# EAGLE schematic ModuleCarrier-MTS-Dragonfly (EAGLE 7.7.0)

## Sheet 1 of 2
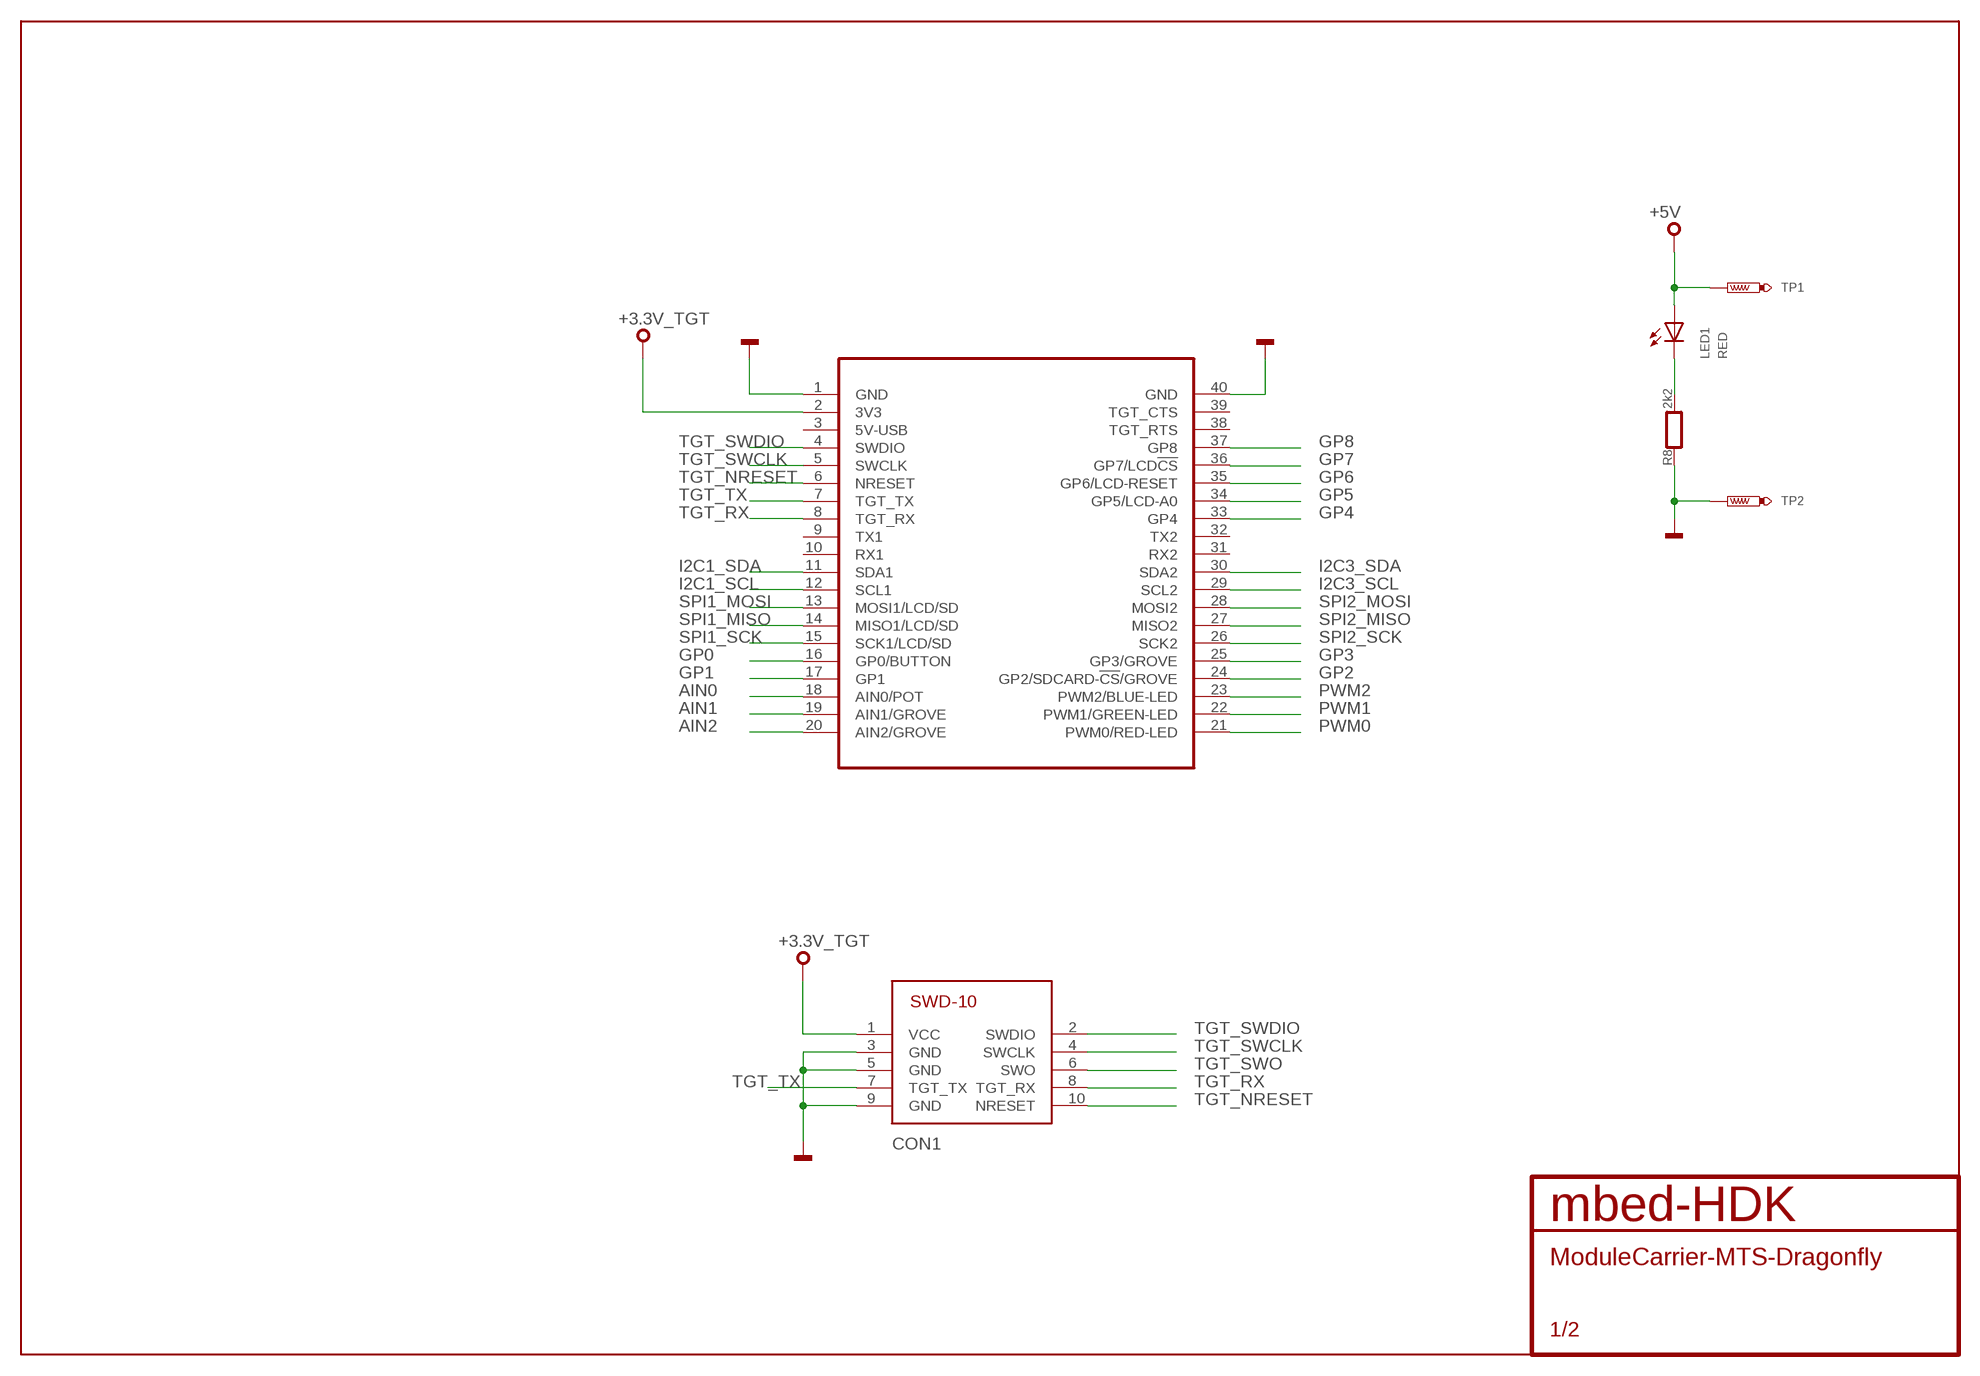
[diagram p0: schematic, sheet 1]

### Parts
CON1  SWD-10/TC2050_SMD  [FTSH-105-02]
LED1  RED  SMD_LED0603  [CHIPLED_0603]
MOD2  MODULE_DAUGHTER  [MODULE_DAUGHTER]
R8  2k2  RESISTOR0603  [0603]
TP1  TEST-POINT-50R-PTH  [TP50-PTH]
TP2  TEST-POINT-50R-PTH  [TP50-PTH]

### Nets
+3.3V_TGT: CON1.1(VCC) MOD2.2(3V3)
+5V: LED1.A TP1.TP ; also sheet 2
AIN0: MOD2.18(AIN0/POT) ; also sheet 2
AIN1: MOD2.19(AIN1/GROVE) ; also sheet 2
AIN2: MOD2.20(AIN2/GROVE) ; also sheet 2
GND: CON1.3(GND) CON1.5(GND) CON1.9(GND) MOD2.1(GND) MOD2.40(GND) R8.1 TP2.TP ; also sheet 2
GP0: MOD2.16(GP0/BUTTON) ; also sheet 2
GP1: MOD2.17(GP1) ; also sheet 2
GP2: MOD2.24(GP2/SDCARD-!CS!/GROVE) ; also sheet 2
GP3: MOD2.25(GP3/GROVE) ; also sheet 2
GP4: MOD2.33(GP4) ; also sheet 2
GP5: MOD2.34(GP5/LCD-A0) ; also sheet 2
GP6: MOD2.35(GP6/LCD-RESET) ; also sheet 2
GP7: MOD2.36(GP7/LCD!CS) ; also sheet 2
GP8: MOD2.37(GP8) ; also sheet 2
I2C1_SCL: MOD2.12(SCL1) ; also sheet 2
I2C1_SDA: MOD2.11(SDA1) ; also sheet 2
I2C3_SCL: MOD2.29(SCL2) ; also sheet 2
I2C3_SDA: MOD2.30(SDA2) ; also sheet 2
PA_1: LED1.C R8.2
PWM0: MOD2.21(PWM0/RED-LED) ; also sheet 2
PWM1: MOD2.22(PWM1/GREEN-LED) ; also sheet 2
PWM2: MOD2.23(PWM2/BLUE-LED) ; also sheet 2
SPI1_MISO: MOD2.14(MISO1/LCD/SD) ; also sheet 2
SPI1_MOSI: MOD2.13(MOSI1/LCD/SD) ; also sheet 2
SPI1_SCK: MOD2.15(SCK1/LCD/SD) ; also sheet 2
SPI2_MISO: MOD2.27(MISO2) ; also sheet 2
SPI2_MOSI: MOD2.28(MOSI2) ; also sheet 2
SPI2_SCK: MOD2.26(SCK2) ; also sheet 2
TGT_NRESET: CON1.10(NRESET) MOD2.6(NRESET) ; also sheet 2
TGT_RX: CON1.8(TGT_RX) MOD2.8(TGT_RX) ; also sheet 2
TGT_SWCLK: CON1.4(SWCLK) MOD2.5(SWCLK) ; also sheet 2
TGT_SWDIO: CON1.2(SWDIO) MOD2.4(SWDIO) ; also sheet 2
TGT_SWO: CON1.6(SWO) ; also sheet 2
TGT_TX: CON1.7(TGT_TX) MOD2.7(TGT_TX) ; also sheet 2
Unconnected: MOD2.3(5V-USB) MOD2.9(TX1) MOD2.10(RX1) MOD2.31(RX2) MOD2.32(TX2) MOD2.38(TGT_RTS) MOD2.39(TGT_CTS)

## Sheet 2 of 2
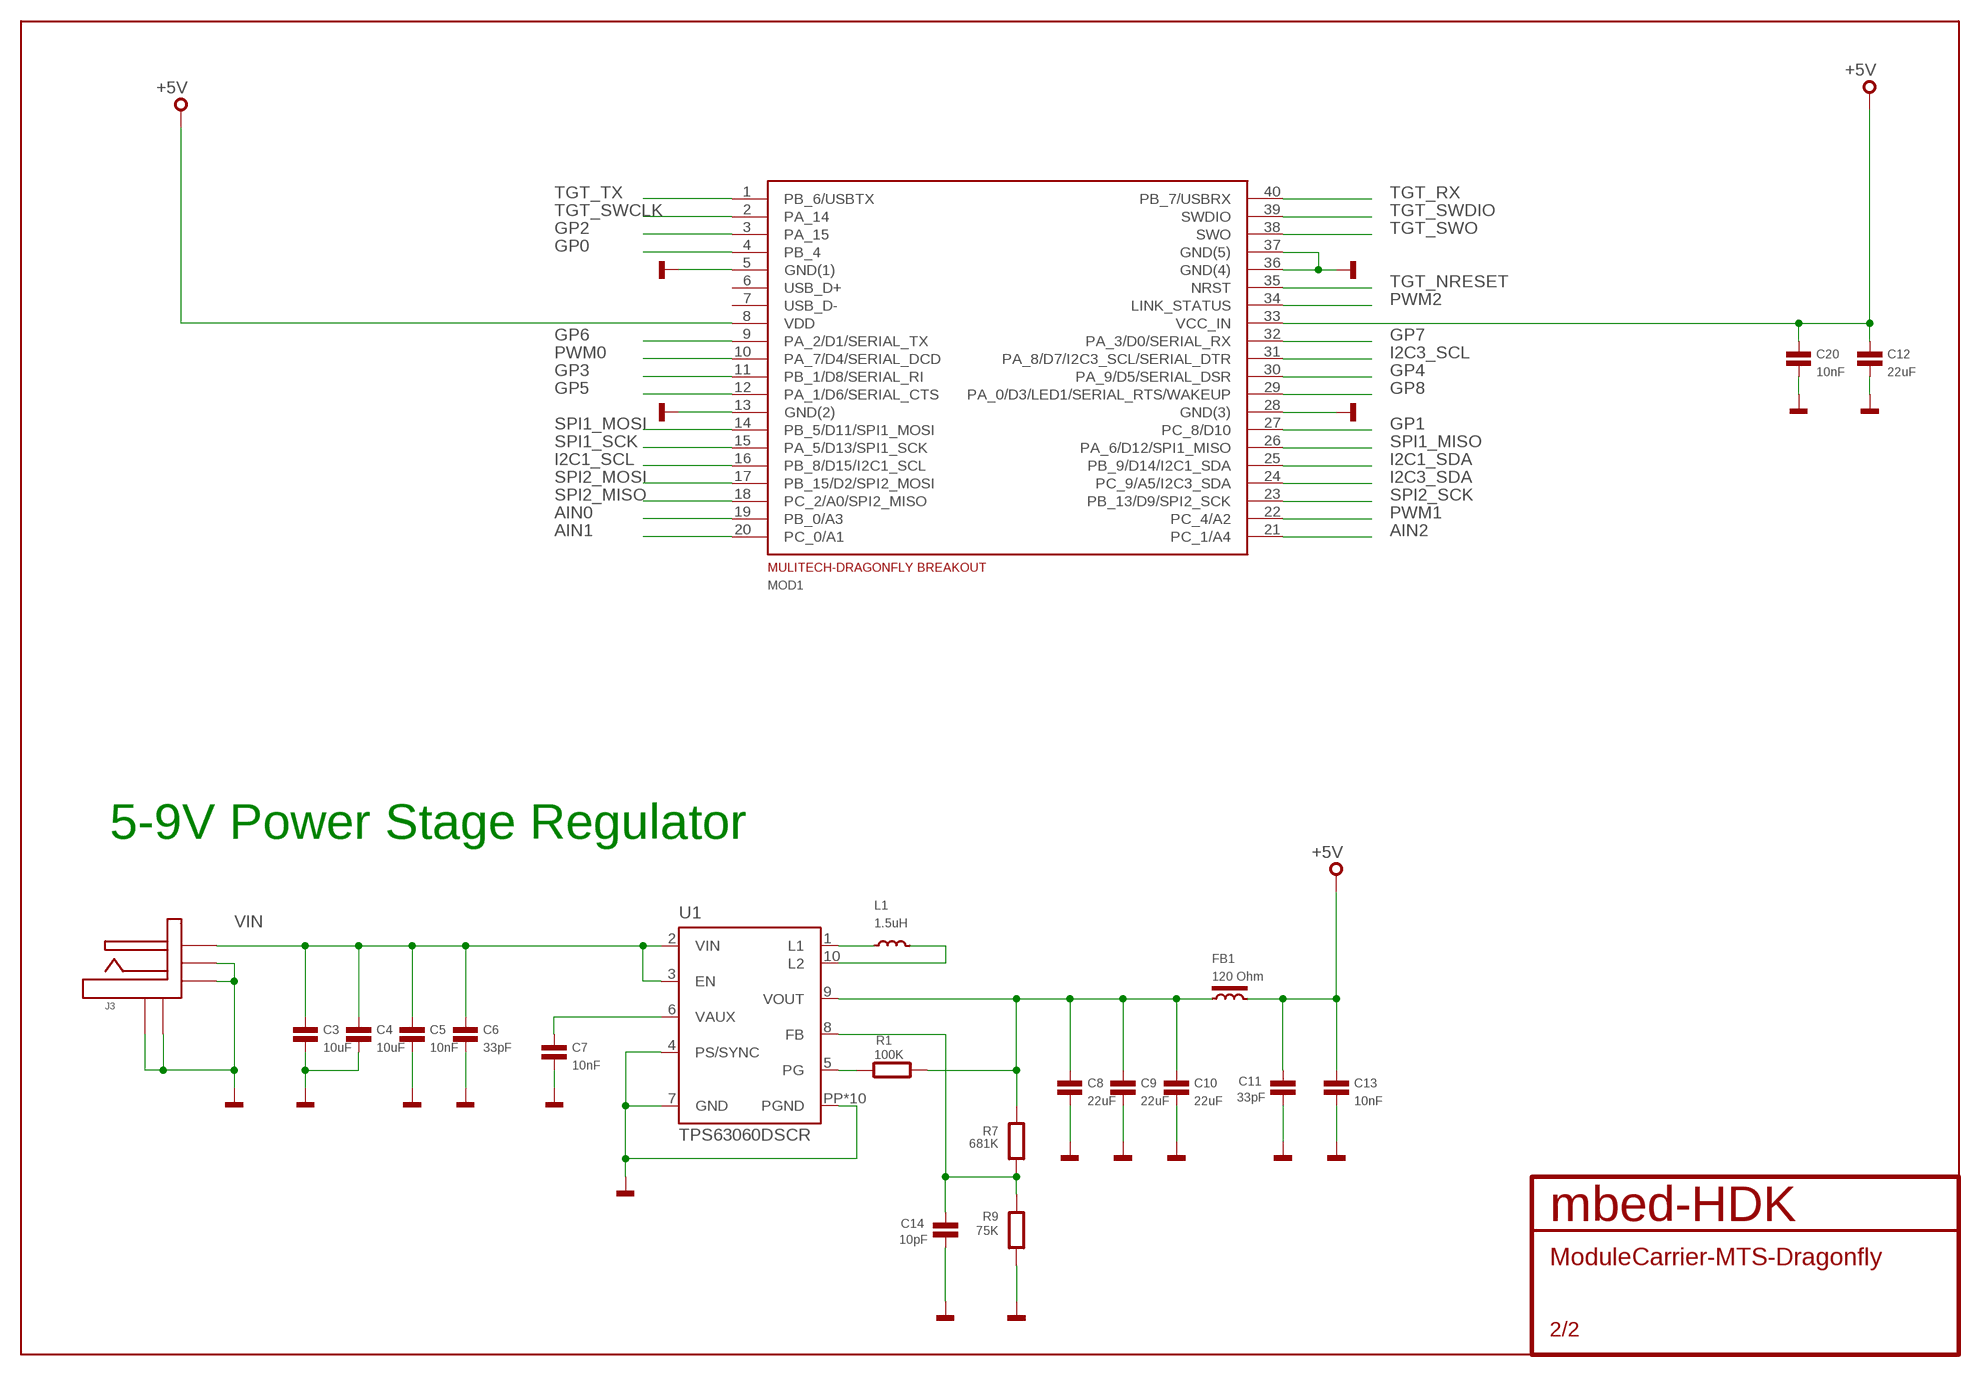
[diagram p1: schematic, sheet 2]

### Parts
C3  10uF  CAPACITOR0603  [0603]
C4  10uF  CAPACITOR0603  [0603]
C5  10nF  CAPACITOR0603  [0603]
C6  33pF  CAPACITOR0603  [0603]
C7  10nF  CAPACITOR0603  [0603]
C8  22uF  CAPACITOR0603  [0603]
C9  22uF  CAPACITOR0603  [0603]
C10  22uF  CAPACITOR0603  [0603]
C11  33pF  CAPACITOR0603  [0603]
C12  22uF  CAPACITOR0603  [0603]
C13  10nF  CAPACITOR0603  [0603]
C14  10pF  CAPACITOR0603  [0603]
C20  10nF  CAPACITOR0603  [0603]
FB1  120 Ohm  FERRITE0603  [0603]
J3  FC68145S  [FC68145S]
L1  1.5uH  INDUCTORXFL4020  [XFL4020-472MEC]
MOD1  MULITECH-DRAGONFLY-BREAKOUT  [MULITECH-DRAGONFLY-BREAKOUT]
R1  100K  RESISTOR0402  [0402]
R7  681K  RESISTOR0402  [0402]
R9  75K  RESISTOR0402  [0402]
U1  TPS63060DSCR  [DSC-S-PWSON-N10]

### Nets
+5V: C11.1 C12.1 C13.1 C20.1 FB1.2 MOD1.8(VDD) MOD1.33(VCC_IN) ; also sheet 1
AIN0: MOD1.19(PB_0/A3) ; also sheet 1
AIN1: MOD1.20(PC_0/A1) ; also sheet 1
AIN2: MOD1.21(PC_1/A4) ; also sheet 1
GND: C3.2 C4.2 C5.2 C6.2 C7.2 C8.2 C9.2 C10.2 C11.2 C12.2 C13.2 C14.2 C20.2 J3.CASE1 J3.P$5(CASE2) J3.SHUNT(SWITCHED) J3.SLEEVE MOD1.5(GND(1)) MOD1.13(GND(2)) MOD1.28(GND(3)) MOD1.36(GND(4)) MOD1.37(GND(5)) R9.1 U1.4(PS/SYNC) U1.7(GND) U1.PP(PGND) U1.PP@1(PGND) U1.PP@2(PGND) U1.PP@3(PGND) U1.PP@4(PGND) U1.PP@5(PGND) U1.PP@7(PGND) U1.PP@8(PGND) U1.PP@9(PGND) U1.PP@10(PGND) ; also sheet 1
GP0: MOD1.4(PB_4) ; also sheet 1
GP1: MOD1.27(PC_8/D10) ; also sheet 1
GP2: MOD1.3(PA_15) ; also sheet 1
GP3: MOD1.11(PB_1/D8/SERIAL_RI) ; also sheet 1
GP4: MOD1.30(PA_9/D5/SERIAL_DSR) ; also sheet 1
GP5: MOD1.12(PA_1/D6/SERIAL_CTS) ; also sheet 1
GP6: MOD1.9(PA_2/D1/SERIAL_TX) ; also sheet 1
GP7: MOD1.32(PA_3/D0/SERIAL_RX) ; also sheet 1
GP8: MOD1.29(PA_0/D3/LED1/SERIAL_RTS/WAKEUP) ; also sheet 1
I2C1_SCL: MOD1.16(PB_8/D15/I2C1_SCL) ; also sheet 1
I2C1_SDA: MOD1.25(PB_9/D14/I2C1_SDA) ; also sheet 1
I2C3_SCL: MOD1.31(PA_8/D7/I2C3_SCL/SERIAL_DTR) ; also sheet 1
I2C3_SDA: MOD1.24(PC_9/A5/I2C3_SDA) ; also sheet 1
N$17: C7.1 U1.6(VAUX)
N$18: L1.P$1 U1.1(L1)
N$19: L1.P$2 U1.10(L2)
N$20: C14.1 R7.1 R9.2 U1.8(FB)
N$21: C8.1 C9.1 C10.1 FB1.1 R1.2 R7.2 U1.9(VOUT)
N$23: R1.1 U1.5(PG)
PWM0: MOD1.10(PA_7/D4/SERIAL_DCD) ; also sheet 1
PWM1: MOD1.22(PC_4/A2) ; also sheet 1
PWM2: MOD1.34(LINK_STATUS) ; also sheet 1
SPI1_MISO: MOD1.26(PA_6/D12/SPI1_MISO) ; also sheet 1
SPI1_MOSI: MOD1.14(PB_5/D11/SPI1_MOSI) ; also sheet 1
SPI1_SCK: MOD1.15(PA_5/D13/SPI1_SCK) ; also sheet 1
SPI2_MISO: MOD1.18(PC_2/A0/SPI2_MISO) ; also sheet 1
SPI2_MOSI: MOD1.17(PB_15/D2/SPI2_MOSI) ; also sheet 1
SPI2_SCK: MOD1.23(PB_13/D9/SPI2_SCK) ; also sheet 1
TGT_NRESET: MOD1.35(NRST) ; also sheet 1
TGT_RX: MOD1.40(PB_7/USBRX) ; also sheet 1
TGT_SWCLK: MOD1.2(PA_14) ; also sheet 1
TGT_SWDIO: MOD1.39(SWDIO) ; also sheet 1
TGT_SWO: MOD1.38(SWO) ; also sheet 1
TGT_TX: MOD1.1(PB_6/USBTX) ; also sheet 1
VIN: C3.1 C4.1 C5.1 C6.1 J3.TIP U1.2(VIN) U1.3(EN)
Unconnected: MOD1.6(USB_D+) MOD1.7(USB_D-)

### Notes on the sheet
- 5-9V Power Stage Regulator

## Library data of the parts
C3-C14 C20 = mbed-HDK-RLCQ:CAPACITOR: Capacitor
CON1 = mbed-HDK-Connector:SWD-10/TC2050: 1mm pitch 10-Pin Cortex Programming Header with optional TC2050 footprint solderless interchangeable
FB1 = mbed-HDK-RLCQ:FERRITE: Ferrite Bead
J3 = LabBoard:FC68145S
L1 = mbed-HDK-RLCQ:INDUCTOR: Inductor
LED1 = mbed-HDK-Optical:SMD_LED: LED SMD, Colour Red; MF: Wurth Electronics Inc; MFN: 150060RS75000; OC-DIGIKEY: 732-4978-1-ND; OC-MOUSER: 710-150060RS75000; OC-NEWARK: 2322071
MOD1 = blackbriar:MULITECH-DRAGONFLY-BREAKOUT: Breakout for Multitech Dragonfly; MF: Hirose; MFN: DF17(2.0)-40DP-0.5V(57); OC-DIGIKEY: H11130CT-ND; OC-MOUSER: 798-DF172040DP05V57; OC-NEWARK: 2300341
MOD2 = blackbriar:MODULE_DAUGHTER
R1 R7 R9 = mbed-HDK-RLCQ:RESISTOR: Resistor
R8 = mbed-HDK-RLC:RESISTOR: Resistor
TP1 TP2 = mbed-HDK:TEST-POINT
U1 = mbed-HDK-Power:TPS63060DSCR: Buck Boost Conveter (2.5V-12Vin, 2.5V-8Vout, 2Aout); MF: TEXAS INSTRUMENTS; MFN: TPS63060DSCR; OC-DIGIKEY: 296-30204-1-ND; OC-MOUSER: 595-TPS63060DSCR; OC-NEWARK: 76T8143